# Altium schematic sheet Feet Installation.SchDoc
size Letter; DocumentNumber: 11; SheetNumber: 11; SheetTotal: 11; Pagesize: Letter
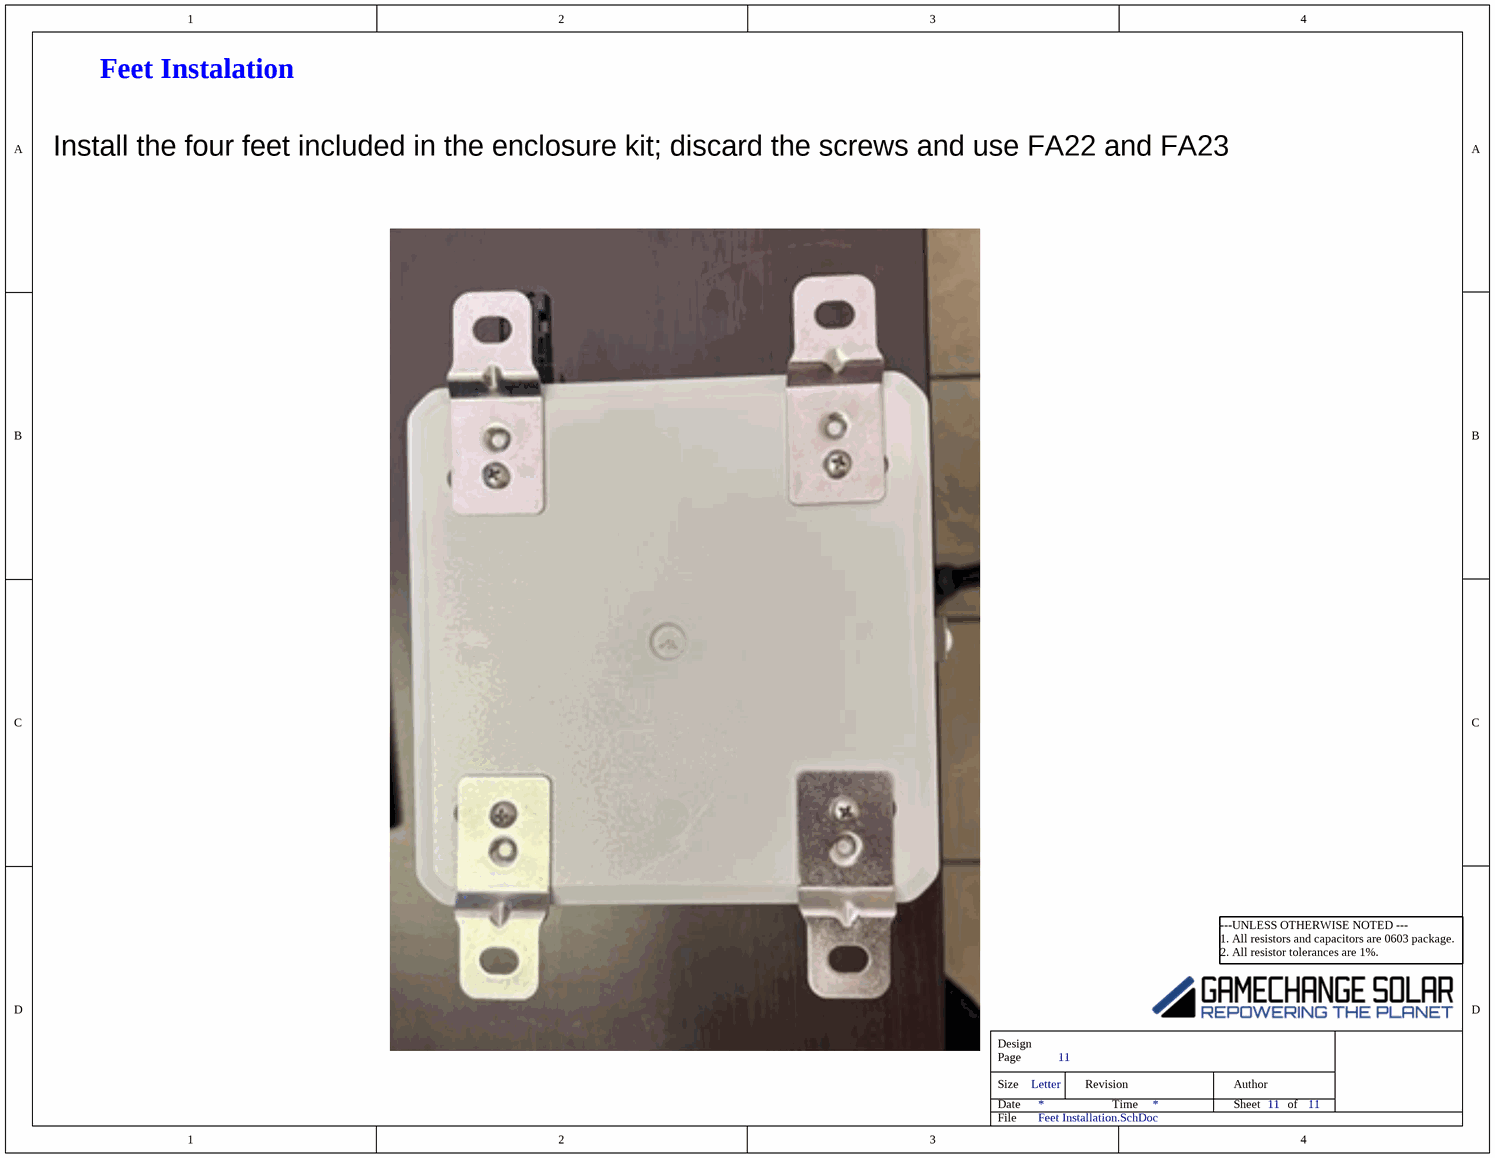
[diagram p0: Feet Installation.SchDoc]

## Notes on the sheet
- Feet Instalation
- Install the four feet included in the enclosure kit; discard the screws and use FA22 and FA23 from the BOM.
- ---UNLESS OTHERWISE NOTED ---
  1. All resistors and capacitors are 0603 package.
  2. All resistor tolerances are 1%.
- Design
- Size
- Date
- Page
- Revision
- Time
- Sheet
- Author
- of
- File